# Altium project PhonePresent.PrjPCB
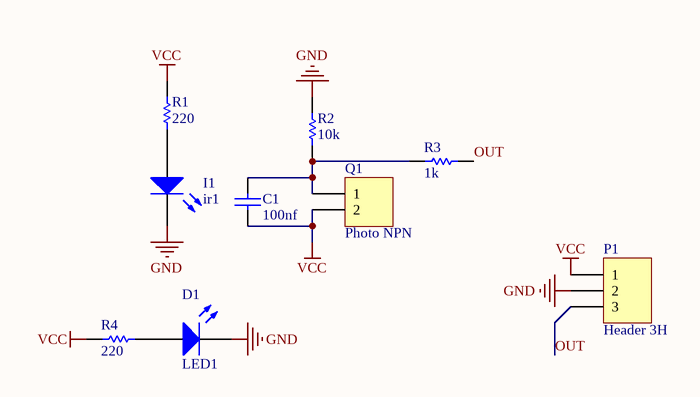
[diagram p0: PhonePresent.SchDoc]
1 sheet, 9 parts. Net scope: global (net labels, ports and power ports of the same name join across sheets).
Board files: PhonePresent.PcbDoc, PhonePresent-oldversion.PcbDoc

## Sheet PhonePresent.SchDoc
size A4

### Parts
C1  value 100nf  [6-0805_M]  (hidden comment: Cap)
D1  LED1  [hdr1x2]
I1  ir1  [HDR1X2]
P1  Header 3H  [HDR1X3H]
Q1  Photo NPN  [HDR1X2]
R1  220  [6-0805_M]
R2  10K  [6-0805_M]
R3  1K  [6-0805_M]
R4  220  [6-0805_M]

### Nets
GND: D1.2(K) I1.2(K) P1.2 R2.1
VCC: C1.2 P1.1 Q1.2 R1.1 R4.1
OUT: P1.3 R3.2
NetC1_1: C1.1 Q1.1 R2.2 R3.1
NetD1_1: D1.1(A) R4.2
NetI1_1: I1.1(A) R1.2

### Notes on the sheet
- Title
- Size:
- Date:
- A4
- Number:
- Time:
- Revision:
- Sheet
- of
- File:

### Library data of the parts
C1 = Cap: Capacitor; Published: 8-Jun-2000; LatestRevisionDate: 17-Jul-2002; LatestRevisionNote: Re-released for DXP Platform.; PackageReference: RAD-0.3; Publisher: Altium Limited; PackageDescription: Radial Cap, Thru-Hole; 2 Leads; 0.3 in Pin Spacing
D1 = LED1: Typical RED GaAs LED; Published: 8-Jun-2000; LatestRevisionDate: 08-Jul-2005; LatestRevisionNote: Mech Layer 1 removed.; PackageReference: LED-1; Publisher: Altium Limited; PackageDescription: LED; 2 Leads
I1 = LED0: Typical INFRARED GaAs LED; Published: 8-Jun-2000; LatestRevisionDate: 08-Jul-2005; LatestRevisionNote: Mech Layer 1 removed.; PackageReference: LED-0; Publisher: Altium Limited; PackageDescription: LED; 2 Leads
P1 = Header 3H: Header, 3-Pin, Right Angle; LatestRevisionDate: 17-Jul-2002; LatestRevisionNote: Re-released for DXP Platform.; Publisher: Altium Limited
Q1 = Header 2: Header, 2-Pin; LatestRevisionDate: 17-Jul-2002; LatestRevisionNote: Re-released for DXP Platform.; Publisher: Altium Limited
R1-R4 = Res1: Resistor; Published: 8-Jun-2000; LatestRevisionDate: 17-Jul-2002; LatestRevisionNote: Re-released for DXP Platform.; PackageReference: AXIAL-0.3; Publisher: Altium Limited; PackageDescription: Axial Device, Thru-Hole; 2 Leads; 0.3 in Pin Spacing
  R1 R4: Value: 220
  R2: Value: 10k
  R3: Value: 1k